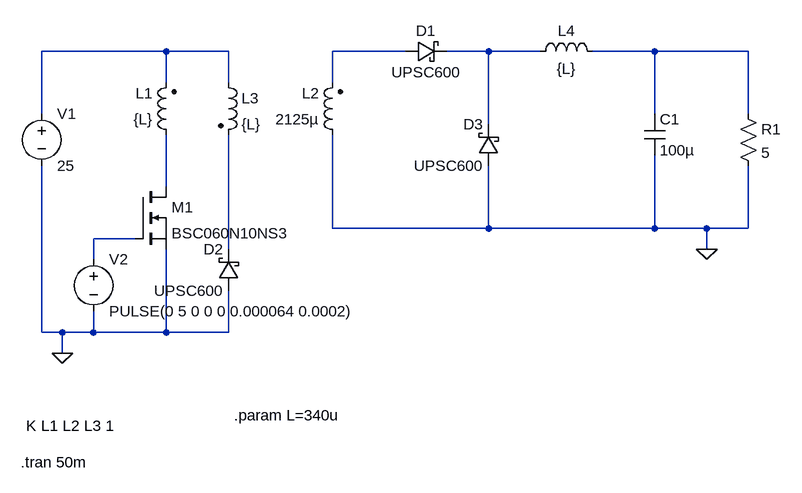
[diagram p0: schematic forward_circuit.asc]
forward_circuit.asc, the LTspice schematic file:
Version 4
SHEET 1 992 680
WIRE 32 -144 -160 -144
WIRE 128 -144 32 -144
WIRE 400 -144 288 -144
WIRE 528 -144 464 -144
WIRE 608 -144 528 -144
WIRE 784 -144 688 -144
WIRE 928 -144 784 -144
WIRE 32 -96 32 -144
WIRE 128 -96 128 -144
WIRE 288 -96 288 -144
WIRE -160 -48 -160 -144
WIRE 784 -48 784 -144
WIRE 928 -48 928 -144
WIRE 528 -32 528 -144
WIRE 32 64 32 -16
WIRE 288 128 288 -16
WIRE 528 128 528 32
WIRE 528 128 288 128
WIRE 784 128 784 16
WIRE 784 128 528 128
WIRE 864 128 784 128
WIRE 928 128 928 32
WIRE 928 128 864 128
WIRE -16 144 -80 144
WIRE 128 160 128 -16
WIRE 864 160 864 128
WIRE -80 176 -80 144
WIRE -160 288 -160 32
WIRE -128 288 -160 288
WIRE -80 288 -80 256
WIRE -80 288 -128 288
WIRE 32 288 32 160
WIRE 32 288 -80 288
WIRE 128 288 128 224
WIRE 128 288 32 288
WIRE -128 320 -128 288
FLAG 864 160 0
FLAG -128 320 0
SYMBOL voltage -160 -64 R0
WINDOW 123 0 0 Left 0
WINDOW 39 0 0 Left 0
SYMATTR InstName V1
SYMATTR Value 25
SYMBOL res 912 -64 R0
SYMATTR InstName R1
SYMATTR Value 5
SYMBOL voltage -80 160 R0
WINDOW 123 0 0 Left 0
WINDOW 39 0 0 Left 0
SYMATTR InstName V2
SYMATTR Value PULSE(0 5 0 0 0 0.000064 0.0002)
SYMBOL schottky 400 -128 R270
WINDOW 0 32 32 VTop 2
WINDOW 3 0 32 VBottom 2
SYMATTR InstName D1
SYMATTR Value UPSC600
SYMATTR Description Diode
SYMATTR Type diode
SYMBOL nmos -16 64 R0
SYMATTR InstName M1
SYMATTR Value BSC060N10NS3
SYMBOL ind2 112 -112 R0
SYMATTR InstName L3
SYMATTR Value {L}
SYMATTR Type ind
SYMBOL ind2 304 0 R180
WINDOW 0 36 80 Left 2
WINDOW 3 36 40 Left 2
SYMATTR InstName L2
SYMATTR Value 2125µ
SYMATTR Type ind
SYMBOL cap 768 -48 R0
SYMATTR InstName C1
SYMATTR Value 100µ
SYMBOL ind2 48 0 R180
WINDOW 0 36 80 Left 2
WINDOW 3 36 40 Left 2
SYMATTR InstName L1
SYMATTR Value {L}
SYMATTR Type ind
SYMBOL schottky 144 224 R180
WINDOW 0 24 64 Left 2
WINDOW 3 24 0 Left 2
SYMATTR InstName D2
SYMATTR Value UPSC600
SYMATTR Description Diode
SYMATTR Type diode
SYMBOL schottky 544 32 R180
WINDOW 0 24 64 Left 2
WINDOW 3 24 0 Left 2
SYMATTR InstName D3
SYMATTR Value UPSC600
SYMATTR Description Diode
SYMATTR Type diode
SYMBOL ind 592 -128 R270
WINDOW 0 32 56 VTop 2
WINDOW 3 5 56 VBottom 2
SYMATTR InstName L4
SYMATTR Value {L}
TEXT -192 488 Left 2 !.tran 50m
TEXT -184 432 Left 2 !K L1 L2 L3 1
TEXT 136 416 Left 2 !.param L=340u

The netlist it stands for:
* forward_circuit.asc
V1 N001 0 25
R1 N004 0 5
V2 N006 0 PULSE(0 5 0 0 0 0.000064 0.0002)
D1 N002 N003 UPSC600
M1 N005 N006 0 0 BSC060N10NS3
L3 N001 N007 {L}
L2 0 N002 2125µ
C1 N004 0 100µ
L1 N005 N001 {L}
D2 0 N007 UPSC600
D3 0 N003 UPSC600
L4 N003 N004 {L}
.model D D
.lib standard.dio
.model NMOS NMOS
.model PMOS PMOS
.lib standard.mos
.tran 50m
K L1 L2 L3 1
.param L=340u
.backanno
.end